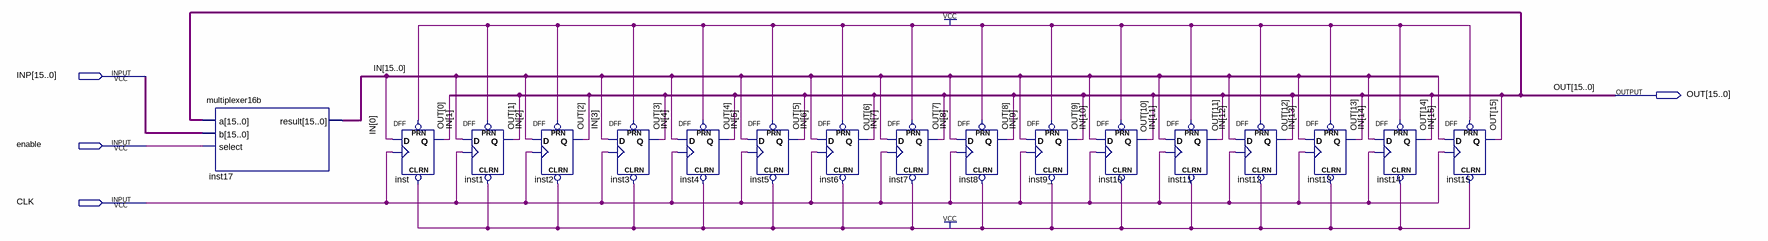
[diagram p0: schematic sheet]
// Quartus schematic 16bitReg.bdf as structural Verilog: 17 symbols, 4 pins
module \16bitReg  (
  input  [15:0] INP,
  input  enable,
  input  CLK,
  output [15:0] OUT
);

  wire [15:0] IN;

  multiplexer16b inst17 (.a(OUT), .b(INP), .select(enable), .result(IN));
  DFF inst (.CLRN(1'b1), .CLK(CLK), .D(IN[0]), .PRN(1'b1), .Q(OUT[0]));
  DFF inst1 (.CLRN(1'b1), .CLK(CLK), .D(IN[1]), .PRN(1'b1), .Q(OUT[1]));
  DFF inst2 (.CLRN(1'b1), .CLK(CLK), .D(IN[2]), .PRN(1'b1), .Q(OUT[2]));
  DFF inst3 (.CLRN(1'b1), .CLK(CLK), .D(IN[3]), .PRN(1'b1), .Q(OUT[3]));
  DFF inst4 (.CLRN(1'b1), .CLK(CLK), .D(IN[4]), .PRN(1'b1), .Q(OUT[4]));
  DFF inst5 (.CLRN(1'b1), .CLK(CLK), .D(IN[5]), .PRN(1'b1), .Q(OUT[5]));
  DFF inst6 (.CLRN(1'b1), .CLK(CLK), .D(IN[6]), .PRN(1'b1), .Q(OUT[6]));
  DFF inst7 (.CLRN(1'b1), .CLK(CLK), .D(IN[7]), .PRN(1'b1), .Q(OUT[7]));
  DFF inst8 (.CLRN(1'b1), .CLK(CLK), .D(IN[8]), .PRN(1'b1), .Q(OUT[8]));
  DFF inst9_ (.CLRN(1'b1), .CLK(CLK), .D(IN[9]), .PRN(1'b1), .Q(OUT[9]));
  DFF inst10 (.CLRN(1'b1), .CLK(CLK), .D(IN[10]), .PRN(1'b1), .Q(OUT[10]));
  DFF inst11 (.CLRN(1'b1), .CLK(CLK), .D(IN[11]), .PRN(1'b1), .Q(OUT[11]));
  DFF inst12 (.CLRN(1'b1), .CLK(CLK), .D(IN[12]), .PRN(1'b1), .Q(OUT[12]));
  DFF inst13 (.CLRN(1'b1), .CLK(CLK), .D(IN[13]), .PRN(1'b1), .Q(OUT[13]));
  DFF inst14 (.CLRN(1'b1), .CLK(CLK), .D(IN[14]), .PRN(1'b1), .Q(OUT[14]));
  DFF inst15 (.CLRN(1'b1), .CLK(CLK), .D(IN[15]), .PRN(1'b1), .Q(OUT[15]));
endmodule
